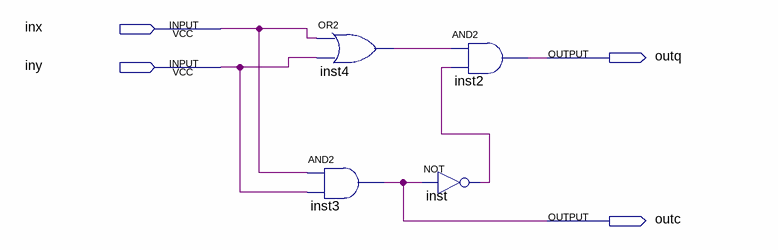
[diagram p0: schematic sheet]
// Quartus schematic SM1_Kostenko.bdf as structural Verilog: 4 symbols, 4 pins
module SM1_Kostenko (
  input  inx,
  input  iny,
  output outq,
  output outc
);

  wire inst4_out, inst_out;

  or inst4 (inst4_out, inx, iny);
  and inst3 (outc, inx, iny);
  not inst (inst_out, outc);
  and inst2 (outq, inst4_out, inst_out);
endmodule
